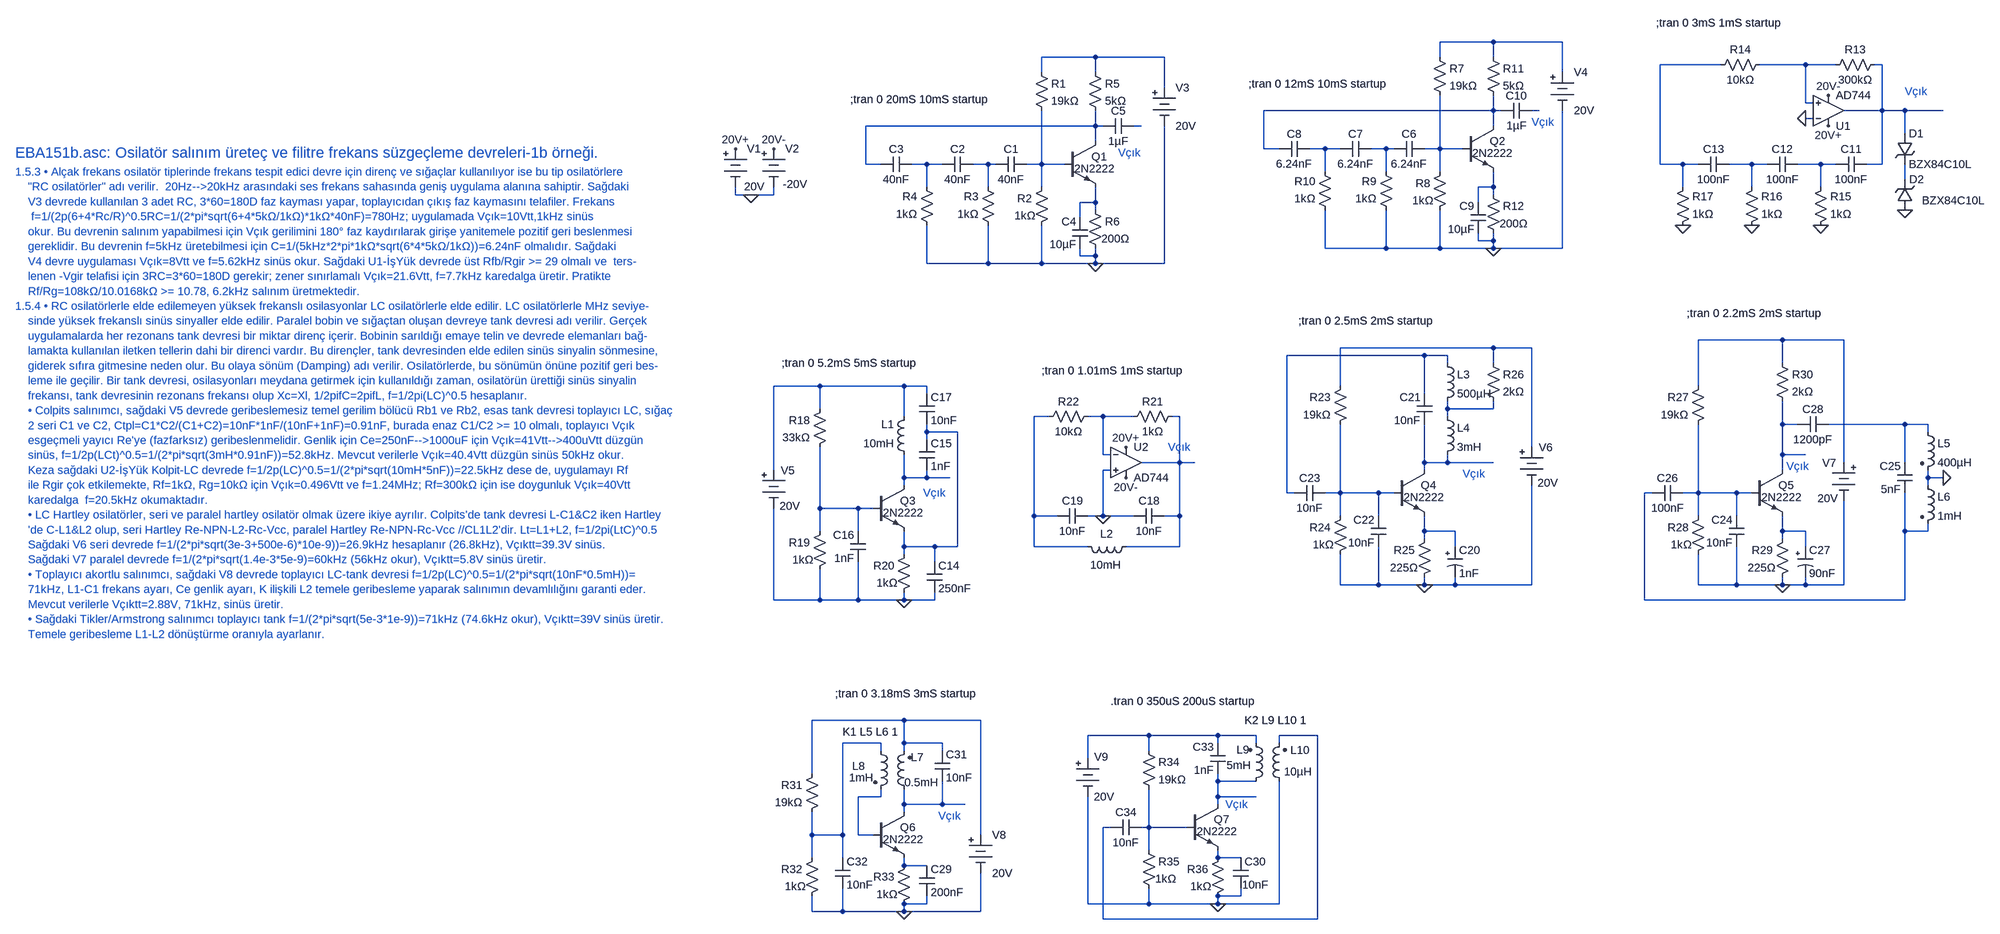
[diagram p0: schematic EBA151b.asc]
EBA151b.asc, the LTspice schematic file:
Version 4
SHEET 1 5332 4332
WIRE 3024 -176 2912 -176
WIRE 3168 -176 3024 -176
WIRE 2192 -144 2080 -144
WIRE 2336 -144 2192 -144
WIRE 2912 -144 2912 -176
WIRE 3024 -144 3024 -176
WIRE 3520 -128 3392 -128
WIRE 3696 -128 3600 -128
WIRE 3760 -128 3696 -128
WIRE 3856 -128 3840 -128
WIRE 2080 -112 2080 -144
WIRE 2192 -112 2192 -144
WIRE 3168 -112 3168 -176
WIRE 2336 -80 2336 -144
WIRE 3696 -48 3696 -128
WIRE 3712 -48 3696 -48
WIRE 3024 -32 3024 -64
WIRE 3024 -32 2544 -32
WIRE 3040 -32 3024 -32
WIRE 3120 -32 3104 -32
WIRE 3856 -32 3856 -128
WIRE 3856 -32 3776 -32
WIRE 3904 -32 3856 -32
WIRE 3984 -32 3904 -32
WIRE 3712 -16 3696 -16
WIRE 2192 0 2192 -32
WIRE 2192 0 1712 0
WIRE 2208 0 2192 0
WIRE 2288 0 2272 0
WIRE 3024 0 3024 -32
WIRE 3904 16 3904 -32
WIRE 2192 32 2192 0
WIRE 2544 48 2544 -32
WIRE 2576 48 2544 48
WIRE 2672 48 2640 48
WIRE 2704 48 2672 48
WIRE 2800 48 2768 48
WIRE 2816 48 2800 48
WIRE 2912 48 2912 -64
WIRE 2912 48 2880 48
WIRE 2960 48 2912 48
WIRE 1712 80 1712 0
WIRE 1744 80 1712 80
WIRE 1840 80 1808 80
WIRE 1872 80 1840 80
WIRE 1968 80 1936 80
WIRE 1984 80 1968 80
WIRE 2080 80 2080 -32
WIRE 2080 80 2048 80
WIRE 2128 80 2080 80
WIRE 3392 80 3392 -128
WIRE 3440 80 3392 80
WIRE 3472 80 3440 80
WIRE 3584 80 3536 80
WIRE 3616 80 3584 80
WIRE 3728 80 3680 80
WIRE 3760 80 3728 80
WIRE 3856 80 3856 -32
WIRE 3856 80 3824 80
WIRE 2672 96 2672 48
WIRE 2800 96 2800 48
WIRE 2912 96 2912 48
WIRE 3904 112 3904 80
WIRE 1840 128 1840 80
WIRE 1968 128 1968 80
WIRE 2080 128 2080 80
WIRE 3024 128 3024 96
WIRE 3024 128 2992 128
WIRE 3440 128 3440 80
WIRE 3584 128 3584 80
WIRE 3728 128 3728 80
WIRE 1440 144 1440 128
WIRE 1472 144 1440 144
WIRE 1520 144 1520 128
WIRE 1520 144 1472 144
WIRE 3024 144 3024 128
WIRE 2192 160 2192 128
WIRE 2192 160 2160 160
WIRE 2992 160 2992 128
WIRE 2192 176 2192 160
WIRE 2160 192 2160 160
WIRE 2992 240 2992 224
WIRE 3024 240 3024 224
WIRE 3024 240 2992 240
WIRE 2672 256 2672 176
WIRE 2800 256 2800 176
WIRE 2800 256 2672 256
WIRE 2912 256 2912 176
WIRE 2912 256 2800 256
WIRE 3024 256 3024 240
WIRE 3024 256 2912 256
WIRE 3168 256 3168 -32
WIRE 3168 256 3024 256
WIRE 2160 272 2160 256
WIRE 2192 272 2192 256
WIRE 2192 272 2160 272
WIRE 1840 288 1840 208
WIRE 1968 288 1968 208
WIRE 1968 288 1840 288
WIRE 2080 288 2080 208
WIRE 2080 288 1968 288
WIRE 2192 288 2192 272
WIRE 2192 288 2080 288
WIRE 2336 288 2336 0
WIRE 2336 288 2192 288
WIRE 3648 448 3472 448
WIRE 3776 448 3648 448
WIRE 3024 464 2704 464
WIRE 3104 464 3024 464
WIRE 2880 480 2592 480
WIRE 2928 480 2880 480
WIRE 2928 496 2928 480
WIRE 3024 496 3024 464
WIRE 3648 496 3648 448
WIRE 1616 544 1520 544
WIRE 1792 544 1616 544
WIRE 1840 544 1792 544
WIRE 2704 544 2704 464
WIRE 3472 544 3472 448
WIRE 1840 560 1840 544
WIRE 2880 560 2880 480
WIRE 1616 592 1616 544
WIRE 2928 592 2928 576
WIRE 3024 592 3024 576
WIRE 3024 592 2928 592
WIRE 1792 608 1792 544
WIRE 2096 608 2064 608
WIRE 2208 608 2176 608
WIRE 2272 608 2208 608
WIRE 2368 608 2352 608
WIRE 2928 608 2928 592
WIRE 3648 624 3648 576
WIRE 3680 624 3648 624
WIRE 3904 624 3744 624
WIRE 3952 624 3904 624
WIRE 1840 640 1840 624
WIRE 1904 640 1840 640
WIRE 3952 640 3952 624
WIRE 1840 656 1840 640
WIRE 3104 672 3104 464
WIRE 2208 688 2208 608
WIRE 2224 688 2208 688
WIRE 3648 688 3648 624
WIRE 3696 688 3648 688
WIRE 2368 704 2368 608
WIRE 2368 704 2288 704
WIRE 2400 704 2368 704
WIRE 2880 704 2880 624
WIRE 2928 704 2928 688
WIRE 2928 704 2880 704
WIRE 3024 704 2928 704
WIRE 3776 704 3776 448
WIRE 3904 704 3904 624
WIRE 1520 720 1520 544
WIRE 2224 720 2208 720
WIRE 2880 720 2880 704
WIRE 3648 720 3648 688
WIRE 1792 736 1792 688
WIRE 1840 736 1840 720
WIRE 1840 736 1792 736
WIRE 1888 736 1840 736
WIRE 3952 736 3952 720
WIRE 3984 736 3952 736
WIRE 1792 752 1792 736
WIRE 3952 752 3952 736
WIRE 2592 768 2592 480
WIRE 2608 768 2592 768
WIRE 2704 768 2704 624
WIRE 2704 768 2672 768
WIRE 2784 768 2704 768
WIRE 2816 768 2784 768
WIRE 3376 768 3360 768
WIRE 3472 768 3472 624
WIRE 3472 768 3440 768
WIRE 3552 768 3472 768
WIRE 3584 768 3552 768
WIRE 1616 800 1616 672
WIRE 1696 800 1616 800
WIRE 1728 800 1696 800
WIRE 2064 816 2064 608
WIRE 2112 816 2064 816
WIRE 2208 816 2208 720
WIRE 2208 816 2176 816
WIRE 2272 816 2208 816
WIRE 2368 816 2368 704
WIRE 2368 816 2336 816
WIRE 2704 816 2704 768
WIRE 2784 816 2784 768
WIRE 3472 816 3472 768
WIRE 3552 816 3552 768
WIRE 1616 848 1616 800
WIRE 1696 848 1696 800
WIRE 2880 848 2880 816
WIRE 2944 848 2880 848
WIRE 3648 848 3648 816
WIRE 3696 848 3648 848
WIRE 3904 848 3904 768
WIRE 3952 848 3952 832
WIRE 3952 848 3904 848
WIRE 2880 864 2880 848
WIRE 3648 864 3648 848
WIRE 1792 880 1792 848
WIRE 1856 880 1792 880
WIRE 1904 880 1904 640
WIRE 1904 880 1856 880
WIRE 2064 880 2064 816
WIRE 2176 880 2064 880
WIRE 2368 880 2368 816
WIRE 2368 880 2256 880
WIRE 2944 880 2944 848
WIRE 3696 880 3696 848
WIRE 1792 896 1792 880
WIRE 1856 912 1856 880
WIRE 2704 960 2704 896
WIRE 2784 960 2784 880
WIRE 2784 960 2704 960
WIRE 2880 960 2880 944
WIRE 2880 960 2784 960
WIRE 2944 960 2944 944
WIRE 2944 960 2880 960
WIRE 3104 960 3104 752
WIRE 3104 960 2944 960
WIRE 3472 960 3472 896
WIRE 3552 960 3552 880
WIRE 3552 960 3472 960
WIRE 3648 960 3648 944
WIRE 3648 960 3552 960
WIRE 3696 960 3696 944
WIRE 3696 960 3648 960
WIRE 3776 960 3776 784
WIRE 3776 960 3696 960
WIRE 1520 992 1520 800
WIRE 1616 992 1616 928
WIRE 1616 992 1520 992
WIRE 1696 992 1696 912
WIRE 1696 992 1616 992
WIRE 1792 992 1792 976
WIRE 1792 992 1696 992
WIRE 1856 992 1856 976
WIRE 1856 992 1792 992
WIRE 3360 992 3360 768
WIRE 3904 992 3904 848
WIRE 3904 992 3360 992
WIRE 1792 1280 1600 1280
WIRE 1952 1280 1792 1280
WIRE 2304 1312 2176 1312
WIRE 2448 1312 2304 1312
WIRE 2528 1312 2448 1312
WIRE 2656 1312 2576 1312
WIRE 1744 1328 1664 1328
WIRE 1792 1328 1792 1280
WIRE 1872 1328 1792 1328
WIRE 2448 1328 2448 1312
WIRE 2528 1328 2528 1312
WIRE 2576 1328 2576 1312
WIRE 1744 1344 1744 1328
WIRE 1792 1344 1792 1328
WIRE 1872 1344 1872 1328
WIRE 2304 1344 2304 1312
WIRE 2176 1360 2176 1312
WIRE 1600 1392 1600 1280
WIRE 2448 1408 2448 1392
WIRE 2528 1408 2448 1408
WIRE 1744 1440 1744 1424
WIRE 1744 1440 1696 1440
WIRE 2448 1440 2448 1408
WIRE 2528 1440 2448 1440
WIRE 1792 1456 1792 1424
WIRE 1872 1456 1872 1408
WIRE 1872 1456 1792 1456
WIRE 1920 1456 1872 1456
WIRE 2448 1456 2448 1440
WIRE 1792 1472 1792 1456
WIRE 2224 1504 2208 1504
WIRE 2304 1504 2304 1424
WIRE 2304 1504 2288 1504
WIRE 2384 1504 2304 1504
WIRE 1600 1520 1600 1472
WIRE 1664 1520 1664 1328
WIRE 1664 1520 1600 1520
WIRE 1696 1520 1696 1440
WIRE 1728 1520 1696 1520
WIRE 1952 1520 1952 1280
WIRE 2304 1552 2304 1504
WIRE 1600 1568 1600 1520
WIRE 1664 1568 1664 1520
WIRE 2448 1568 2448 1552
WIRE 2496 1568 2448 1568
WIRE 1792 1584 1792 1568
WIRE 1840 1584 1792 1584
WIRE 2496 1648 2496 1632
WIRE 2496 1648 2448 1648
WIRE 1840 1664 1840 1648
WIRE 1840 1664 1792 1664
WIRE 2176 1664 2176 1440
WIRE 2304 1664 2304 1632
WIRE 2304 1664 2176 1664
WIRE 2448 1664 2448 1648
WIRE 2448 1664 2304 1664
WIRE 2576 1664 2576 1408
WIRE 2576 1664 2448 1664
WIRE 1600 1680 1600 1648
WIRE 1664 1680 1664 1632
WIRE 1664 1680 1600 1680
WIRE 1792 1680 1792 1664
WIRE 1792 1680 1664 1680
WIRE 1952 1680 1952 1600
WIRE 1952 1680 1792 1680
WIRE 2208 1696 2208 1504
WIRE 2656 1696 2656 1312
WIRE 2656 1696 2208 1696
FLAG 1472 144 0
FLAG 1440 48 20V+
FLAG 1520 48 20V-
FLAG 2192 288 0
FLAG 3024 256 0
FLAG 3744 -64 20V-
FLAG 3744 0 20V+
FLAG 3728 208 0
FLAG 3584 208 0
FLAG 3440 208 0
FLAG 3696 -16 0
FLAG 3904 176 0
FLAG 1792 992 0
FLAG 2256 736 20V-
FLAG 2256 672 20V+
FLAG 2208 816 0
FLAG 2880 960 0
FLAG 3648 960 0
FLAG 3984 736 0
FLAG 1792 1680 0
FLAG 2448 1664 0
SYMBOL Misc\\battery 1440 32 R0
WINDOW 3 18 95 Left 2
SYMATTR Value 20V
SYMATTR InstName V1
SYMBOL Misc\\battery 1520 32 R0
WINDOW 3 19 90 Left 2
SYMATTR Value -20V
SYMATTR InstName V2
SYMBOL npn 2128 32 R0
WINDOW 3 20 57 Left 2
SYMATTR Value 2N2222
SYMATTR InstName Q1
SYMBOL res 2064 -128 R0
SYMATTR InstName R1
SYMATTR Value 19kΩ
SYMBOL Misc\\battery 2336 -96 R0
SYMATTR InstName V3
SYMATTR Value 20V
SYMBOL res 2096 112 M0
WINDOW 3 29 76 Left 2
SYMATTR Value 1kΩ
SYMATTR InstName R2
SYMBOL res 1984 224 R180
WINDOW 0 36 76 Left 2
WINDOW 3 36 40 Left 2
SYMATTR InstName R3
SYMATTR Value 1kΩ
SYMBOL res 1856 224 R180
WINDOW 0 36 76 Left 2
WINDOW 3 36 40 Left 2
SYMATTR InstName R4
SYMATTR Value 1kΩ
SYMBOL cap 1984 64 M90
WINDOW 0 0 32 VBottom 2
WINDOW 3 32 32 VTop 2
SYMATTR InstName C1
SYMATTR Value 40nF
SYMBOL cap 1872 64 M90
WINDOW 0 0 32 VBottom 2
WINDOW 3 32 32 VTop 2
SYMATTR InstName C2
SYMATTR Value 40nF
SYMBOL cap 1744 64 M90
WINDOW 0 0 32 VBottom 2
WINDOW 3 32 32 VTop 2
SYMATTR InstName C3
SYMATTR Value 40nF
SYMBOL res 2176 -128 R0
SYMATTR InstName R5
SYMATTR Value 5kΩ
SYMBOL res 2176 160 R0
WINDOW 3 29 76 Left 2
SYMATTR Value 200Ω
SYMATTR InstName R6
SYMBOL cap 2176 192 M0
SYMATTR InstName C4
SYMATTR Value 10µF
SYMBOL cap 2208 -16 M90
WINDOW 0 0 32 VBottom 2
WINDOW 3 32 32 VTop 2
SYMATTR InstName C5
SYMATTR Value 1µF
SYMBOL npn 2960 0 R0
WINDOW 3 20 57 Left 2
SYMATTR Value 2N2222
SYMATTR InstName Q2
SYMBOL res 2896 -160 R0
SYMATTR InstName R7
SYMATTR Value 19kΩ
SYMBOL Misc\\battery 3168 -128 R0
SYMATTR InstName V4
SYMATTR Value 20V
SYMBOL res 2928 80 M0
WINDOW 3 29 76 Left 2
SYMATTR Value 1kΩ
SYMATTR InstName R8
SYMBOL res 2816 192 R180
WINDOW 0 36 76 Left 2
WINDOW 3 36 40 Left 2
SYMATTR InstName R9
SYMATTR Value 1kΩ
SYMBOL res 2688 192 R180
WINDOW 0 36 76 Left 2
WINDOW 3 36 40 Left 2
SYMATTR InstName R10
SYMATTR Value 1kΩ
SYMBOL cap 2816 32 M90
WINDOW 0 0 32 VBottom 2
WINDOW 3 32 32 VTop 2
SYMATTR InstName C6
SYMATTR Value 6.24nF
SYMBOL cap 2704 32 M90
WINDOW 0 0 32 VBottom 2
WINDOW 3 32 32 VTop 2
SYMATTR InstName C7
SYMATTR Value 6.24nF
SYMBOL cap 2576 32 M90
WINDOW 0 0 32 VBottom 2
WINDOW 3 32 32 VTop 2
SYMATTR InstName C8
SYMATTR Value 6.24nF
SYMBOL res 3008 -160 R0
SYMATTR InstName R11
SYMATTR Value 5kΩ
SYMBOL res 3008 128 R0
WINDOW 3 29 76 Left 2
SYMATTR Value 200Ω
SYMATTR InstName R12
SYMBOL cap 3008 160 M0
SYMATTR InstName C9
SYMATTR Value 10µF
SYMBOL cap 3040 -48 M90
WINDOW 0 0 32 VBottom 2
WINDOW 3 32 32 VTop 2
SYMATTR InstName C10
SYMATTR Value 1µF
SYMBOL OpAmps\\AD744 3744 32 M180
SYMATTR InstName U1
SYMBOL res 3856 -144 R90
WINDOW 0 0 56 VBottom 2
WINDOW 3 32 56 VTop 2
SYMATTR InstName R13
SYMATTR Value 300kΩ
SYMBOL res 3616 -144 R90
WINDOW 0 0 56 VBottom 2
WINDOW 3 32 56 VTop 2
SYMATTR InstName R14
SYMATTR Value 10kΩ
SYMBOL cap 3824 64 R90
WINDOW 0 0 32 VBottom 2
WINDOW 3 32 32 VTop 2
SYMATTR InstName C11
SYMATTR Value 100nF
SYMBOL res 3712 224 M180
WINDOW 0 36 76 Left 2
WINDOW 3 36 40 Left 2
SYMATTR InstName R15
SYMATTR Value 1kΩ
SYMBOL cap 3680 64 R90
WINDOW 0 0 32 VBottom 2
WINDOW 3 32 32 VTop 2
SYMATTR InstName C12
SYMATTR Value 100nF
SYMBOL res 3568 224 M180
WINDOW 0 36 76 Left 2
WINDOW 3 36 40 Left 2
SYMATTR InstName R16
SYMATTR Value 1kΩ
SYMBOL cap 3536 64 R90
WINDOW 0 0 32 VBottom 2
WINDOW 3 32 32 VTop 2
SYMATTR InstName C13
SYMATTR Value 100nF
SYMBOL res 3424 224 M180
WINDOW 0 36 76 Left 2
WINDOW 3 36 40 Left 2
SYMATTR InstName R17
SYMATTR Value 1kΩ
SYMBOL zener 3888 16 R0
SYMATTR InstName D1
SYMATTR Value BZX84C10L
SYMATTR Description Diode
SYMATTR Type diode
SYMBOL zener 3920 176 R180
WINDOW 0 -24 64 Left 2
WINDOW 3 -151 20 Left 2
SYMATTR InstName D2
SYMATTR Value BZX84C10L
SYMATTR Description Diode
SYMATTR Type diode
SYMBOL npn 1728 752 R0
WINDOW 3 20 57 Left 2
SYMATTR Value 2N2222
SYMATTR InstName Q3
SYMBOL res 1632 576 M0
SYMATTR InstName R18
SYMATTR Value 33kΩ
SYMBOL Misc\\battery 1520 704 R0
WINDOW 0 15 17 Left 2
WINDOW 3 12 91 Left 2
SYMATTR InstName V5
SYMATTR Value 20V
SYMBOL res 1632 832 M0
WINDOW 3 29 76 Left 2
SYMATTR Value 1kΩ
SYMATTR InstName R19
SYMBOL res 1808 880 M0
WINDOW 3 29 76 Left 2
SYMATTR Value 1kΩ
SYMATTR InstName R20
SYMBOL cap 1840 912 R0
SYMATTR InstName C14
SYMATTR Value 250nF
SYMBOL cap 1824 656 R0
SYMATTR InstName C15
SYMATTR Value 1nF
SYMBOL cap 1712 848 M0
SYMATTR InstName C16
SYMATTR Value 1nF
SYMBOL cap 1824 560 R0
SYMATTR InstName C17
SYMATTR Value 10nF
SYMBOL OpAmps\\AD744 2256 640 R0
SYMATTR InstName U2
SYMBOL res 2368 592 R90
WINDOW 0 0 56 VBottom 2
WINDOW 3 32 56 VTop 2
SYMATTR InstName R21
SYMATTR Value 1kΩ
SYMBOL res 2192 592 R90
WINDOW 0 0 56 VBottom 2
WINDOW 3 32 56 VTop 2
SYMATTR InstName R22
SYMATTR Value 10kΩ
SYMBOL cap 2336 800 R90
WINDOW 0 0 32 VBottom 2
WINDOW 3 32 32 VTop 2
SYMATTR InstName C18
SYMATTR Value 10nF
SYMBOL cap 2176 800 R90
WINDOW 0 0 32 VBottom 2
WINDOW 3 32 32 VTop 2
SYMATTR InstName C19
SYMATTR Value 10nF
SYMBOL ind 2272 864 R90
WINDOW 0 5 56 VBottom 2
WINDOW 3 39 58 VTop 2
SYMATTR InstName L2
SYMATTR Value 10mH
SYMBOL ind 1808 704 R180
WINDOW 0 36 80 Left 2
WINDOW 3 36 40 Left 2
SYMATTR InstName L1
SYMATTR Value 10mH
SYMBOL npn 2816 720 R0
WINDOW 3 20 57 Left 2
SYMATTR Value 2N2222
SYMATTR InstName Q4
SYMBOL res 2720 528 M0
SYMATTR InstName R23
SYMATTR Value 19kΩ
SYMBOL Misc\\battery 3104 656 R0
WINDOW 0 15 17 Left 2
WINDOW 3 12 91 Left 2
SYMATTR InstName V6
SYMATTR Value 20V
SYMBOL res 2720 800 M0
WINDOW 3 29 76 Left 2
SYMATTR Value 1kΩ
SYMATTR InstName R24
SYMBOL res 2896 848 M0
WINDOW 3 29 76 Left 2
SYMATTR Value 225Ω
SYMATTR InstName R25
SYMBOL cap 2800 816 M0
SYMATTR InstName C22
SYMATTR Value 10nF
SYMBOL cap 2896 560 M0
SYMATTR InstName C21
SYMATTR Value 10nF
SYMBOL ind 2912 480 R0
SYMATTR InstName L3
SYMATTR Value 500µH
SYMBOL ind 2912 592 R0
SYMATTR InstName L4
SYMATTR Value 3mH
SYMBOL cap 2672 784 M270
WINDOW 0 32 32 VTop 2
WINDOW 3 0 32 VBottom 2
SYMATTR InstName C23
SYMATTR Value 10nF
SYMBOL res 3008 480 R0
SYMATTR InstName R26
SYMATTR Value 2kΩ
SYMBOL polcap 2928 880 R0
SYMATTR InstName C20
SYMATTR Value 1nF
SYMBOL npn 3584 720 R0
WINDOW 3 20 57 Left 2
SYMATTR Value 2N2222
SYMATTR InstName Q5
SYMBOL res 3488 528 M0
SYMATTR InstName R27
SYMATTR Value 19kΩ
SYMBOL Misc\\battery 3776 688 M0
WINDOW 0 15 17 Left 2
WINDOW 3 12 91 Left 2
SYMATTR InstName V7
SYMATTR Value 20V
SYMBOL res 3488 800 M0
WINDOW 3 29 76 Left 2
SYMATTR Value 1kΩ
SYMATTR InstName R28
SYMBOL res 3664 848 M0
WINDOW 3 29 76 Left 2
SYMATTR Value 225Ω
SYMATTR InstName R29
SYMBOL cap 3568 816 M0
SYMATTR InstName C24
SYMATTR Value 10nF
SYMBOL cap 3920 704 M0
SYMATTR InstName C25
SYMATTR Value 5nF
SYMBOL ind2 3936 624 R0
SYMATTR InstName L5
SYMATTR Value 400µH
SYMATTR Type ind
SYMBOL ind2 3936 736 R0
SYMATTR InstName L6
SYMATTR Value 1mH
SYMATTR Type ind
SYMBOL cap 3440 784 M270
WINDOW 0 32 32 VTop 2
WINDOW 3 0 32 VBottom 2
SYMATTR InstName C26
SYMATTR Value 100nF
SYMBOL res 3632 480 R0
SYMATTR InstName R30
SYMATTR Value 2kΩ
SYMBOL polcap 3680 880 R0
SYMATTR InstName C27
SYMATTR Value 90nF
SYMBOL cap 3744 640 M270
WINDOW 0 32 32 VTop 2
WINDOW 3 0 32 VBottom 2
SYMATTR InstName C28
SYMATTR Value 1200pF
SYMBOL npn 1728 1472 R0
WINDOW 3 20 57 Left 2
SYMATTR Value 2N2222
SYMATTR InstName Q6
SYMBOL res 1616 1376 M0
SYMATTR InstName R31
SYMATTR Value 19kΩ
SYMBOL Misc\\battery 1952 1504 R0
SYMATTR InstName V8
SYMATTR Value 20V
SYMBOL res 1616 1552 M0
WINDOW 3 29 76 Left 2
SYMATTR Value 1kΩ
SYMATTR InstName R32
SYMBOL res 1808 1568 M0
WINDOW 3 29 76 Left 2
SYMATTR Value 1kΩ
SYMATTR InstName R33
SYMBOL cap 1824 1584 R0
SYMATTR InstName C29
SYMATTR Value 200nF
SYMBOL ind2 1808 1440 R180
WINDOW 0 -25 82 Left 2
WINDOW 3 -56 30 Left 2
SYMATTR InstName L7
SYMATTR Value 0.5mH
SYMATTR Type ind
SYMBOL ind2 1728 1328 R0
WINDOW 0 -44 48 Left 2
WINDOW 3 -51 72 Left 2
SYMATTR InstName L8
SYMATTR Value 1mH
SYMATTR Type ind
SYMBOL cap 1856 1344 R0
SYMATTR InstName C31
SYMATTR Value 10nF
SYMBOL cap 1648 1568 R0
SYMATTR InstName C32
SYMATTR Value 10nF
SYMBOL npn 2384 1456 R0
WINDOW 3 20 57 Left 2
SYMATTR Value 2N2222
SYMATTR InstName Q7
SYMBOL res 2288 1328 R0
SYMATTR InstName R34
SYMATTR Value 19kΩ
SYMBOL Misc\\battery 2176 1344 R0
WINDOW 0 14 13 Left 2
WINDOW 3 13 96 Left 2
SYMATTR InstName V9
SYMATTR Value 20V
SYMBOL res 2288 1536 R0
WINDOW 3 29 76 Left 2
SYMATTR Value 1kΩ
SYMATTR InstName R35
SYMBOL res 2464 1552 M0
WINDOW 3 29 76 Left 2
SYMATTR Value 1kΩ
SYMATTR InstName R36
SYMBOL cap 2480 1568 R0
WINDOW 3 19 56 Left 2
SYMATTR InstName C30
SYMATTR Value 10nF
SYMBOL ind2 2512 1424 M180
WINDOW 0 -25 82 Left 2
WINDOW 3 -46 50 Left 2
SYMATTR InstName L9
SYMATTR Value 5mH
SYMATTR Type ind
SYMBOL ind2 2592 1424 R180
WINDOW 0 -48 81 Left 2
WINDOW 3 -52 36 Left 2
SYMATTR InstName L10
SYMATTR Value 10µH
SYMATTR Type ind
SYMBOL cap 2464 1328 M0
SYMATTR InstName C33
SYMATTR Value 1nF
SYMBOL cap 2288 1488 R90
WINDOW 0 0 32 VBottom 2
WINDOW 3 32 32 VTop 2
SYMATTR InstName C34
SYMATTR Value 10nF
TEXT -232 56 Left 3 ;EBA151b.asc: Osilatör salınım üreteç ve filitre frekans süzgeçleme devreleri-1b örneği.
TEXT -232 96 Left 2 ;1.5.3 • Alçak frekans osilatör tiplerinde frekans tespit edici devre için direnç ve sığaçlar kullanılıyor ise bu tip osilatörlere \n    "RC osilatörler" adı verilir.  20Hz-->20kHz arasındaki ses frekans sahasında geniş uygulama alanına sahiptir. Sağdaki\n    V3 devrede kullanılan 3 adet RC, 3*60=180D faz kayması yapar, toplayıcıdan çıkış faz kaymasını telafiler. Frekans\n     f=1/(2p(6+4*Rc/R)^0.5RC=1/(2*pi*sqrt(6+4*5kΩ/1kΩ)*1kΩ*40nF)=780Hz; uygulamada Vçık=10Vtt,1kHz sinüs \n    okur. Bu devrenin salınım yapabilmesi için Vçık gerilimini 180° faz kaydırılarak girişe yanitemele pozitif geri beslenmesi \n    gereklidir. Bu devrenin f=5kHz üretebilmesi için C=1/(5kHz*2*pi*1kΩ*sqrt(6*4*5kΩ/1kΩ))=6.24nF olmalıdır. Sağdaki\n    V4 devre uygulaması Vçık=8Vtt ve f=5.62kHz sinüs okur. Sağdaki U1-İşYük devrede üst Rfb/Rgir >= 29 olmalı ve  ters-\n    lenen -Vgir telafisi için 3RC=3*60=180D gerekir; zener sınırlamalı Vçık=21.6Vtt, f=7.7kHz karedalga üretir. Pratikte\n    Rf/Rg=108kΩ/10.0168kΩ >= 10.78, 6.2kHz salınım üretmektedir.\n1.5.4 • RC osilatörlerle elde edilemeyen yüksek frekanslı osilasyonlar LC osilatörlerle elde edilir. LC osilatörlerle MHz seviye-\n    sinde yüksek frekanslı sinüs sinyaller elde edilir. Paralel bobin ve sığaçtan oluşan devreye tank devresi adı verilir. Gerçek\n    uygulamalarda her rezonans tank devresi bir miktar direnç içerir. Bobinin sarıldığı emaye telin ve devrede elemanları bağ-\n    lamakta kullanılan iletken tellerin dahi bir direnci vardır. Bu dirençler, tank devresinden elde edilen sinüs sinyalin sönmesine, \n    giderek sıfıra gitmesine neden olur. Bu olaya sönüm (Damping) adı verilir. Osilatörlerde, bu sönümün önüne pozitif geri bes-\n    leme ile geçilir. Bir tank devresi, osilasyonları meydana getirmek için kullanıldığı zaman, osilatörün ürettiği sinüs sinyalin \n    frekansı, tank devresinin rezonans frekansı olup Xc=Xl, 1/2pifC=2pifL, f=1/2pi(LC)^0.5 hesaplanır.\n    • Colpits salınımcı, sağdaki V5 devrede geribeslemesiz temel gerilim bölücü Rb1 ve Rb2, esas tank devresi toplayıcı LC, sığaç\n    2 seri C1 ve C2, Ctpl=C1*C2/(C1+C2)=10nF*1nF/(10nF+1nF)=0.91nF, burada enaz C1/C2 >= 10 olmalı, toplayıcı Vçık \n    esgeçmeli yayıcı Re'ye (fazfarksız) geribeslenmelidir. Genlik için Ce=250nF-->1000uF için Vçık=41Vtt-->400uVtt düzgün\n    sinüs, f=1/2p(LCt)^0.5=1/(2*pi*sqrt(3mH*0.91nF))=52.8kHz. Mevcut verilerle Vçık=40.4Vtt düzgün sinüs 50kHz okur.\n    Keza sağdaki U2-İşYük Kolpit-LC devrede f=1/2p(LC)^0.5=1/(2*pi*sqrt(10mH*5nF))=22.5kHz dese de, uygulamayı Rf\n    ile Rgir çok etkilemekte, Rf=1kΩ, Rg=10kΩ için Vçık=0.496Vtt ve f=1.24MHz; Rf=300kΩ için ise doygunluk Vçık=40Vtt \n    karedalga  f=20.5kHz okumaktadır.\n    • LC Hartley osilatörler, seri ve paralel hartley osilatör olmak üzere ikiye ayrılır. Colpits'de tank devresi L-C1&C2 iken Hartley\n    'de C-L1&L2 olup, seri Hartley Re-NPN-L2-Rc-Vcc, paralel Hartley Re-NPN-Rc-Vcc //CL1L2'dir. Lt=L1+L2, f=1/2pi(LtC)^0.5\n    Sağdaki V6 seri devrede f=1/(2*pi*sqrt(3e-3+500e-6)*10e-9))=26.9kHz hesaplanır (26.8kHz), Vçıktt=39.3V sinüs.\n    Sağdaki V7 paralel devrede f=1/(2*pi*sqrt(1.4e-3*5e-9)=60kHz (56kHz okur), Vçıktt=5.8V sinüs üretir.\n    • Toplayıcı akortlu salınımcı, sağdaki V8 devrede toplayıcı LC-tank devresi f=1/2p(LC)^0.5=1/(2*pi*sqrt(10nF*0.5mH))=\n    71kHz, L1-C1 frekans ayarı, Ce genlik ayarı, K ilişkili L2 temele geribesleme yaparak salınımın devamlılığını garanti eder. \n    Mevcut verilerle Vçıktt=2.88V, 71kHz, sinüs üretir.\n    • Sağdaki Tikler/Armstrong salınımcı toplayıcı tank f=1/(2*pi*sqrt(5e-3*1e-9))=71kHz (74.6kHz okur), Vçıktt=39V sinüs üretir.\n    Temele geribesleme L1-L2 dönüştürme oranıyla ayarlanır.
TEXT 2240 56 Left 2 ;Vçık
TEXT 1680 -56 Left 2 !;tran 0 20mS 10mS startup
TEXT 3104 -8 Left 2 ;Vçık
TEXT 2512 -88 Left 2 !;tran 0 12mS 10mS startup
TEXT 3384 -216 Left 2 !;tran 0 3mS 1mS startup
TEXT 3904 -72 Left 2 ;Vçık
TEXT 1832 768 Left 2 ;Vçık
TEXT 1536 496 Left 2 !;tran 0 5.2mS 5mS startup
TEXT 2344 672 Left 2 ;Vçık
TEXT 2080 512 Left 2 !;tran 0 1.01mS 1mS startup
TEXT 2960 728 Left 2 ;Vçık
TEXT 2616 408 Left 2 !;tran 0 2.5mS 2mS startup
TEXT 3656 712 Left 2 ;Vçık
TEXT 3448 392 Left 2 !;tran 0 2.2mS 2mS startup
TEXT 1864 1480 Left 2 ;Vçık
TEXT 1664 1304 Left 2 !K1 L5 L6 1
TEXT 1648 1224 Left 2 !;tran 0 3.18mS 3mS startup
TEXT 2464 1456 Left 2 ;Vçık
TEXT 2504 1280 Left 2 !K2 L9 L10 1
TEXT 2224 1240 Left 2 !.tran 0 350uS 200uS startup

The netlist it stands for:
* EBA151b.asc
V1 20V+ 0 20V
V2 20V- 0 -20V
Q1 N008 N015 N020 0 2N2222
R1 N002 N015 19kΩ
V3 N002 0 20V
R2 N015 0 1kΩ
R3 0 N014 1kΩ
R4 0 N013 1kΩ
C1 N014 N015 40nF
C2 N013 N014 40nF
C3 N008 N013 40nF
R5 N002 N008 5kΩ
R6 N020 0 200Ω
C4 N020 0 10µF
C5 N008 N009 1µF
Q2 N006 N012 N019 0 2N2222
R7 N001 N012 19kΩ
V4 N001 0 20V
R8 N012 0 1kΩ
R9 0 N011 1kΩ
R10 0 N010 1kΩ
C6 N011 N012 6.24nF
C7 N010 N011 6.24nF
C8 N006 N010 6.24nF
R11 N001 N006 5kΩ
R12 N019 0 200Ω
C9 N019 0 10µF
C10 N006 N007 1µF
XU1 N004 0 20V+ 20V- N005 AD744  ; pins In+ In- V+ V- OUT
R13 N005 N004 300kΩ
R14 N004 N003 10kΩ
C11 N005 N017 100nF
R15 0 N017 1kΩ
C12 N017 N016 100nF
R16 0 N016 1kΩ
C13 N016 N003 100nF
R17 0 N003 1kΩ
D1 N005 N018 BZX84C10L
D2 0 N018 BZX84C10L
Q3 N033 N037 N031 0 2N2222
R18 N024 N037 33kΩ
V5 N024 0 20V
R19 N037 0 1kΩ
R20 N031 0 1kΩ
C14 N031 0 250nF
C15 N031 N033 1nF
C16 N037 0 1nF
C17 N024 N031 10nF
XU2 0 N027 20V+ 20V- N028 AD744  ; pins In+ In- V+ V- OUT
R21 N028 N027 1kΩ
R22 N027 N026 10kΩ
C18 N028 0 10nF
C19 0 N026 10nF
L2 N028 N026 10mH
L1 N033 N024 10mH
Q4 N032 N034 N038 0 2N2222
R23 N022 N034 19kΩ
V6 N022 0 20V
R24 N034 0 1kΩ
R25 N038 0 225Ω
C22 N034 0 10nF
C21 N023 N032 10nF
L3 N023 N025 500µH
L4 N025 N032 3mH
C23 N034 N023 10nF
R26 N022 N025 2kΩ
C20 N038 0 1nF
Q5 N029 N036 N039 0 2N2222
R27 N021 N036 19kΩ
V7 N021 0 20V
R28 N036 0 1kΩ
R29 N039 0 225Ω
C24 N036 0 10nF
C25 N030 N035 5nF
L5 N030 0 400µH
L6 0 N035 1mH
C26 N036 N035 100nF
R30 N021 N029 2kΩ
C27 N039 0 90nF
C28 N030 N029 1200pF
Q6 N046 N045 N049 0 2N2222
R31 N040 N043 19kΩ
V8 N040 0 20V
R32 N043 0 1kΩ
R33 N049 0 1kΩ
C29 N049 0 200nF
L7 N046 N040 0.5mH
L8 N043 N045 1mH
C31 N040 N046 10nF
C32 N043 0 10nF
Q7 N044 N047 N048 0 2N2222
R34 N041 N047 19kΩ
V9 N041 0 20V
R35 N047 0 1kΩ
R36 N048 0 1kΩ
C30 N048 0 10nF
L9 N044 N041 5mH
L10 0 N042 10µH
C33 N041 N044 1nF
C34 N047 N042 10nF
.model D D
.lib standard.dio
.model NPN NPN
.model PNP PNP
.lib standard.bjt
* EBA151b.asc: Osilatör salınım üreteç ve filitre frekans süzgeçleme devreleri-1b örneği.
* 1.5.3 • Alçak frekans osilatör tiplerinde frekans tespit edici devre için direnç ve sığaçlar kullanılıyor ise bu tip osilatörlere
*     "RC osilatörler" adı verilir.  20Hz-->20kHz arasındaki ses frekans sahasında geniş uygulama alanına sahiptir. Sağdaki
*     V3 devrede kullanılan 3 adet RC, 3*60=180D faz kayması yapar, toplayıcıdan çıkış faz kaymasını telafiler. Frekans
*      f=1/(2p(6+4*Rc/R)^0.5RC=1/(2*pi*sqrt(6+4*5kΩ/1kΩ)*1kΩ*40nF)=780Hz; uygulamada Vçık=10Vtt,1kHz sinüs
*     okur. Bu devrenin salınım yapabilmesi için Vçık gerilimini 180° faz kaydırılarak girişe yanitemele pozitif geri beslenmesi
*     gereklidir. Bu devrenin f=5kHz üretebilmesi için C=1/(5kHz*2*pi*1kΩ*sqrt(6*4*5kΩ/1kΩ))=6.24nF olmalıdır. Sağdaki
*     V4 devre uygulaması Vçık=8Vtt ve f=5.62kHz sinüs okur. Sağdaki U1-İşYük devrede üst Rfb/Rgir >= 29 olmalı ve  ters-
*     lenen -Vgir telafisi için 3RC=3*60=180D gerekir; zener sınırlamalı Vçık=21.6Vtt, f=7.7kHz karedalga üretir. Pratikte
*     Rf/Rg=108kΩ/10.0168kΩ >= 10.78, 6.2kHz salınım üretmektedir.
* 1.5.4 • RC osilatörlerle elde edilemeyen yüksek frekanslı osilasyonlar LC osilatörlerle elde edilir. LC osilatörlerle MHz seviye-
*     sinde yüksek frekanslı sinüs sinyaller elde edilir. Paralel bobin ve sığaçtan oluşan devreye tank devresi adı verilir. Gerçek
*     uygulamalarda her rezonans tank devresi bir miktar direnç içerir. Bobinin sarıldığı emaye telin ve devrede elemanları bağ-
*     lamakta kullanılan iletken tellerin dahi bir direnci vardır. Bu dirençler, tank devresinden elde edilen sinüs sinyalin sönmesine,
*     giderek sıfıra gitmesine neden olur. Bu olaya sönüm (Damping) adı verilir. Osilatörlerde, bu sönümün önüne pozitif geri bes-
*     leme ile geçilir. Bir tank devresi, osilasyonları meydana getirmek için kullanıldığı zaman, osilatörün ürettiği sinüs sinyalin
*     frekansı, tank devresinin rezonans frekansı olup Xc=Xl, 1/2pifC=2pifL, f=1/2pi(LC)^0.5 hesaplanır.
*     • Colpits salınımcı, sağdaki V5 devrede geribeslemesiz temel gerilim bölücü Rb1 ve Rb2, esas tank devresi toplayıcı LC, sığaç
*     2 seri C1 ve C2, Ctpl=C1*C2/(C1+C2)=10nF*1nF/(10nF+1nF)=0.91nF, burada enaz C1/C2 >= 10 olmalı, toplayıcı Vçık
*     esgeçmeli yayıcı Re'ye (fazfarksız) geribeslenmelidir. Genlik için Ce=250nF-->1000uF için Vçık=41Vtt-->400uVtt düzgün
*     sinüs, f=1/2p(LCt)^0.5=1/(2*pi*sqrt(3mH*0.91nF))=52.8kHz. Mevcut verilerle Vçık=40.4Vtt düzgün sinüs 50kHz okur.
*     Keza sağdaki U2-İşYük Kolpit-LC devrede f=1/2p(LC)^0.5=1/(2*pi*sqrt(10mH*5nF))=22.5kHz dese de, uygulamayı Rf
*     ile Rgir çok etkilemekte, Rf=1kΩ, Rg=10kΩ için Vçık=0.496Vtt ve f=1.24MHz; Rf=300kΩ için ise doygunluk Vçık=40Vtt
*     karedalga  f=20.5kHz okumaktadır.
*     • LC Hartley osilatörler, seri ve paralel hartley osilatör olmak üzere ikiye ayrılır. Colpits'de tank devresi L-C1&C2 iken Hartley
*     'de C-L1&L2 olup, seri Hartley Re-NPN-L2-Rc-Vcc, paralel Hartley Re-NPN-Rc-Vcc //CL1L2'dir. Lt=L1+L2, f=1/2pi(LtC)^0.5
*     Sağdaki V6 seri devrede f=1/(2*pi*sqrt(3e-3+500e-6)*10e-9))=26.9kHz hesaplanır (26.8kHz), Vçıktt=39.3V sinüs.
*     Sağdaki V7 paralel devrede f=1/(2*pi*sqrt(1.4e-3*5e-9)=60kHz (56kHz okur), Vçıktt=5.8V sinüs üretir.
*     • Toplayıcı akortlu salınımcı, sağdaki V8 devrede toplayıcı LC-tank devresi f=1/2p(LC)^0.5=1/(2*pi*sqrt(10nF*0.5mH))=
*     71kHz, L1-C1 frekans ayarı, Ce genlik ayarı, K ilişkili L2 temele geribesleme yaparak salınımın devamlılığını garanti eder.
*     Mevcut verilerle Vçıktt=2.88V, 71kHz, sinüs üretir.
*     • Sağdaki Tikler/Armstrong salınımcı toplayıcı tank f=1/(2*pi*sqrt(5e-3*1e-9))=71kHz (74.6kHz okur), Vçıktt=39V sinüs üretir.
*     Temele geribesleme L1-L2 dönüştürme oranıyla ayarlanır.
* Vçık
;tran 0 20mS 10mS startup
* Vçık
;tran 0 12mS 10mS startup
;tran 0 3mS 1mS startup
* Vçık
* Vçık
;tran 0 5.2mS 5mS startup
* Vçık
;tran 0 1.01mS 1mS startup
* Vçık
;tran 0 2.5mS 2mS startup
* Vçık
;tran 0 2.2mS 2mS startup
* Vçık
K1 L5 L6 1
;tran 0 3.18mS 3mS startup
* Vçık
K2 L9 L10 1
.tran 0 350uS 200uS startup
.backanno
.end